# EAGLE design DR_RewardWellpcb_v2.5 (EAGLE 7.2.0)
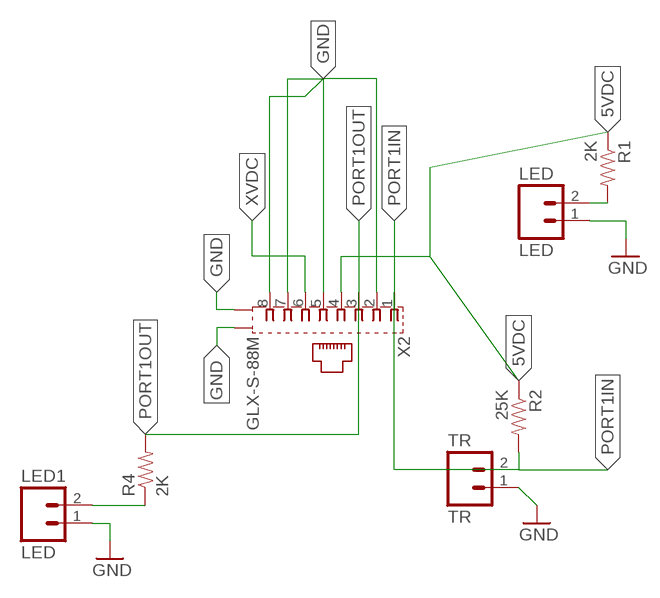
[diagram p0: schematic, sheet 1]

## Parts
LED  LED  M02PTH  [1X02]
LED1  LED  M02PTH  [1X02]
R1  2K  RESISTOR1206  [1206]
R2  25K  RESISTOR1206  [1206]
R4  2K  RESISTOR1206  [1206]
TR  TR  M02PTH  [1X02]
X2  GLX-S-88M  [GLX-S-88M]

## Nets
5VDC: R1.1 R2.1 X2.4
GND: LED1.1 LED.1 TR.1 X2.2 X2.7 X2.8 X2.S1 X2.S2
N$2: LED.2 R1.2
N$4: LED1.2 R4.1
PORT1IN: R2.2 TR.2 X2.1
PORT1OUT: R4.2 X2.3
XVDC: X2.6
Unconnected: X2.5

## Library data of the parts
LED LED1 TR = SparkFun:M02: Header 2 Standard 2-pin 0.1" header. Use with straight break away headers (SKU : PRT-00116), right angle break away headers (PRT-00553), swiss pins (PRT-00743), machine pins (PRT-00117), and female headers (PRT-00115). Molex polarized connector foot print use with SKU : PRT-08233 with associated crimp pins and housings.
R1 R2 R4 = SparkFun:RESISTOR: Resistor Basic schematic elements and footprints for 0603, 1206, and PTH 1/10th watt (small) resistors.
X2 = con-kycon:GLX-S-88M: Mod. Jack, Right Angle, 8 posiotion, 8 contatcs RJ45 Source: GLX-S-88M.pdf; OC_FARNELL: unknown; OC_NEWARK: unknown

## Board
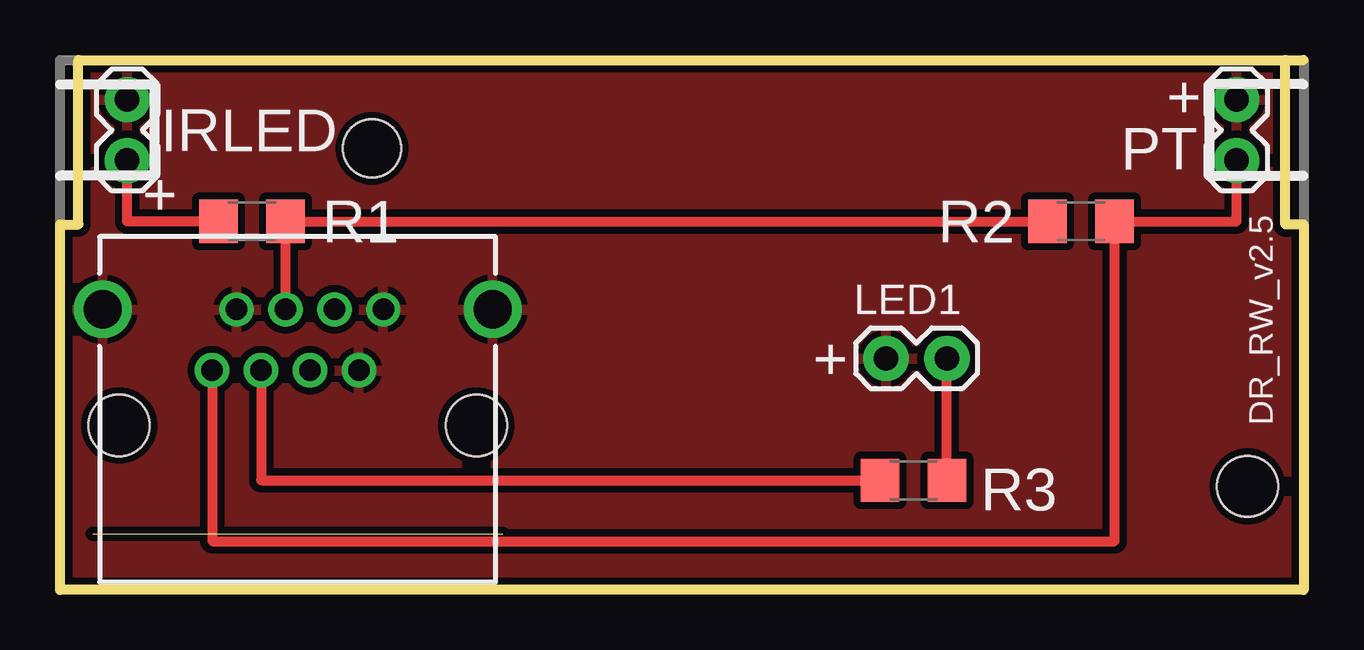
[diagram p1: board, top side]
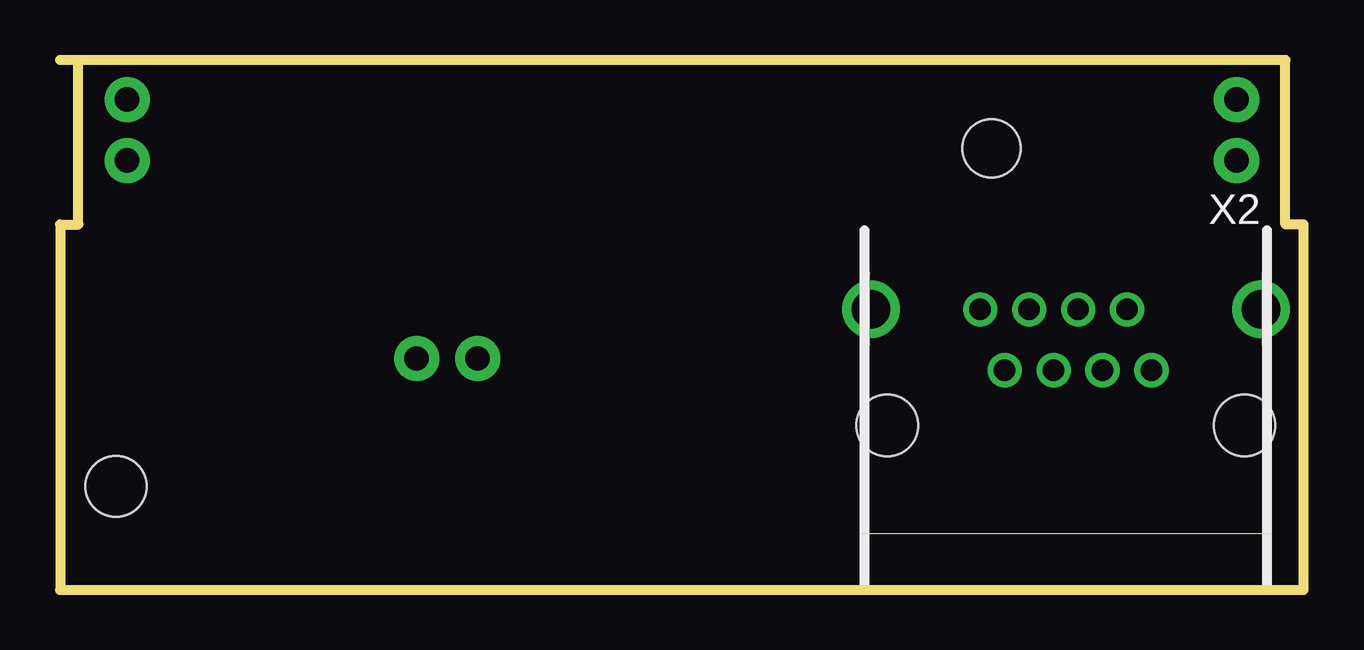
[diagram p2: board, bottom side, seen from below]

Size 51.82 x 22.1 mm. Coordinates in mm from the lower left corner, seen from the top.
Outline: 51.05,22.1 0.76,22.1 0.76,15.24 0,15.24 0,0 51.82,0 51.82,15.24 51.05,15.24 51.05,22.1
Outline: 51.05,22.1 51.82,22.1
Copper layers (1*16): Top 0.035mm / dielectric 1.5mm / Bottom 0.035mm
Design rules "SeeedStudio_2layer_DRU_no_angle_20140221": minimum track width 6mil, minimum drill 12mil, track to track 6mil, track to pad 6mil, pad to pad 6mil, via to via 6mil, smd to smd 0mil, copper to edge 10mil, drill to drill 10mil, minimum pad ring 10mil, minimum via ring 6mil, stop-mask expansion 2mil, vias tented up to drill 100mil, thermal gap 10mil
Holes 2.54 mm at 49.48,4.32
Holes 2.41 mm at 13,18.41

### Footprints (pad centres in the part's own frame; a part is rotated, then mirrored left to right if it is on the bottom)
1X02 = drill 1.016 pad 1.88: 1 0,0; 2 2.54,0
1206 = smd 1.6 x 1.8: 1 -1.4,0; 2 1.4,0
GLX-S-88M = drill 0.9 pad 1.422: 1 -3.57,-2.3; 2 -2.55,-4.84; 3 -1.53,-2.3; 4 -0.51,-4.84; 5 0.51,-2.3; 6 1.53,-4.84; 7 2.55,-2.3; 8 3.57,-4.84 | drill 1.6 pad 2.184: S1 -8.125,-4.84; S2 8.125,-4.84 | hole 2.55: -7.44,0; 7.44,0

### Placement (x,y rotation side)
LED  2.79,20.45 270 top
LED1  34.42,9.65 0 top
R1  8,15.37 180 top
R2  42.55,15.37 0 top
R4  35.56,4.57 180 top
TR  49.02,20.45 270 top
X2  9.91,6.86 180 bottom

### Tracks (layer width: path | path; a pad name or v marks a point on that pad's centre or on a via)
5VDC
  Top 0.406: R2.1 R1.1 X2.4
GND
  pour Top (isolate 0.305): 0.76,22.1 51.05,22.1 51.05,15.24 51.82,15.24 51.82,0 0,0 0,15.24 0.76,15.24
N$2
  Top 0.406: R1.2 2.79,15.37 LED.2
N$4
  Top 0.406: R4.1 36.96,4.06 LED1.2
PORT1IN
  Top 0.406: TR.2 49.02,15.37 R2.2 43.95,2.03 6.35,2.03 X2.1
PORT1OUT
  Top 0.406: X2.3 8.38,4.57 R4.2

### Text on the board
tPlace: + | IRLED | PT | + | R1 | R2 | + | DR_RW_v2.5 | R3